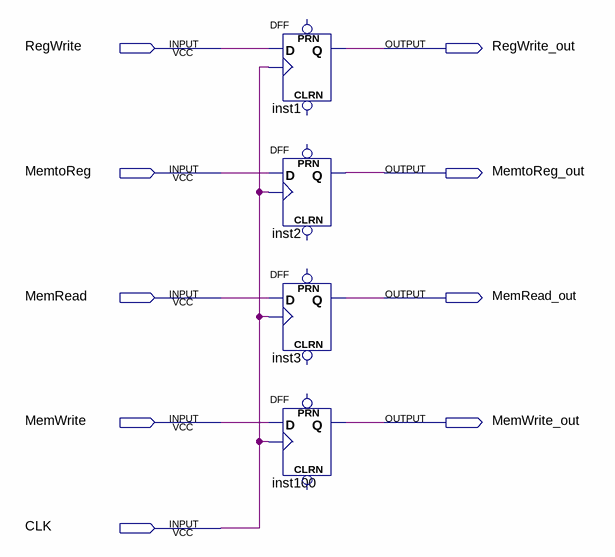
[diagram p0: schematic sheet]
// Quartus schematic EX_MEM_control.bdf as structural Verilog: 4 symbols, 9 pins
module EX_MEM_control (
  input  RegWrite,
  input  MemtoReg,
  input  MemRead,
  input  MemWrite,
  input  CLK,
  output RegWrite_out,
  output MemtoReg_out,
  output MemRead_out,
  output MemWrite_out
);

  DFF inst1 (.CLK(CLK), .D(RegWrite), .Q(RegWrite_out));  // open: CLRN, PRN
  DFF inst2 (.CLK(CLK), .D(MemtoReg), .Q(MemtoReg_out));  // open: CLRN, PRN
  DFF inst3 (.CLK(CLK), .D(MemRead), .Q(MemRead_out));  // open: CLRN, PRN
  DFF inst100 (.CLK(CLK), .D(MemWrite), .Q(MemWrite_out));  // open: CLRN, PRN
endmodule
